# Altium schematic sheet 06-DETECT-ps2-blueretro.SchDoc
size A; SheetNumber: 7; SheetTotal: 7
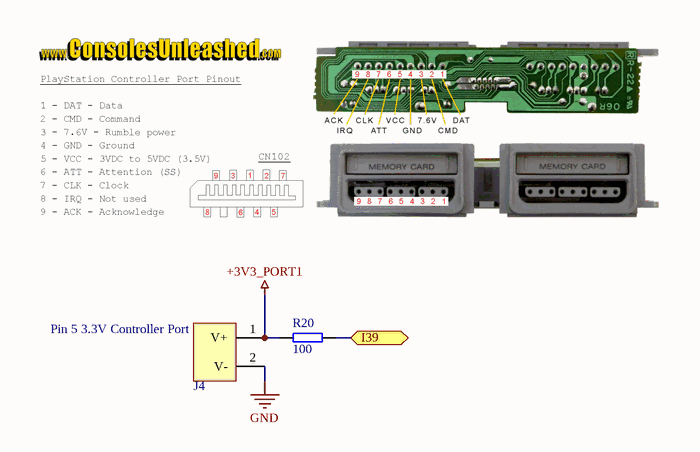
[diagram p0: 06-DETECT-ps2-blueretro.SchDoc]

## Parts
J4  2 Pole 2.54mm  [2.54mm_2pole]  (value not drawn)  (no BOM)
R20  value 100  [res_0603]  (hidden comment: res_0603)

## Ports
I39 (bidir, see 00-ps2-blueretro[3D], 01-ESP32-ps2-blueretro[2B])

## Nets
+3V3_PORT1: J4.1(V+) R20.2
GND: J4.2(V-)
I39: R20.1 ; port I39

## Notes on the sheet
- (near J4) Pin 5 3.3V Controller Port

## Library data of the parts
J4 = 2 Pole 2.54mm: Solder contacts for a 2.54mm connector